# Altium schematic sheet Main.SchDoc
size A4
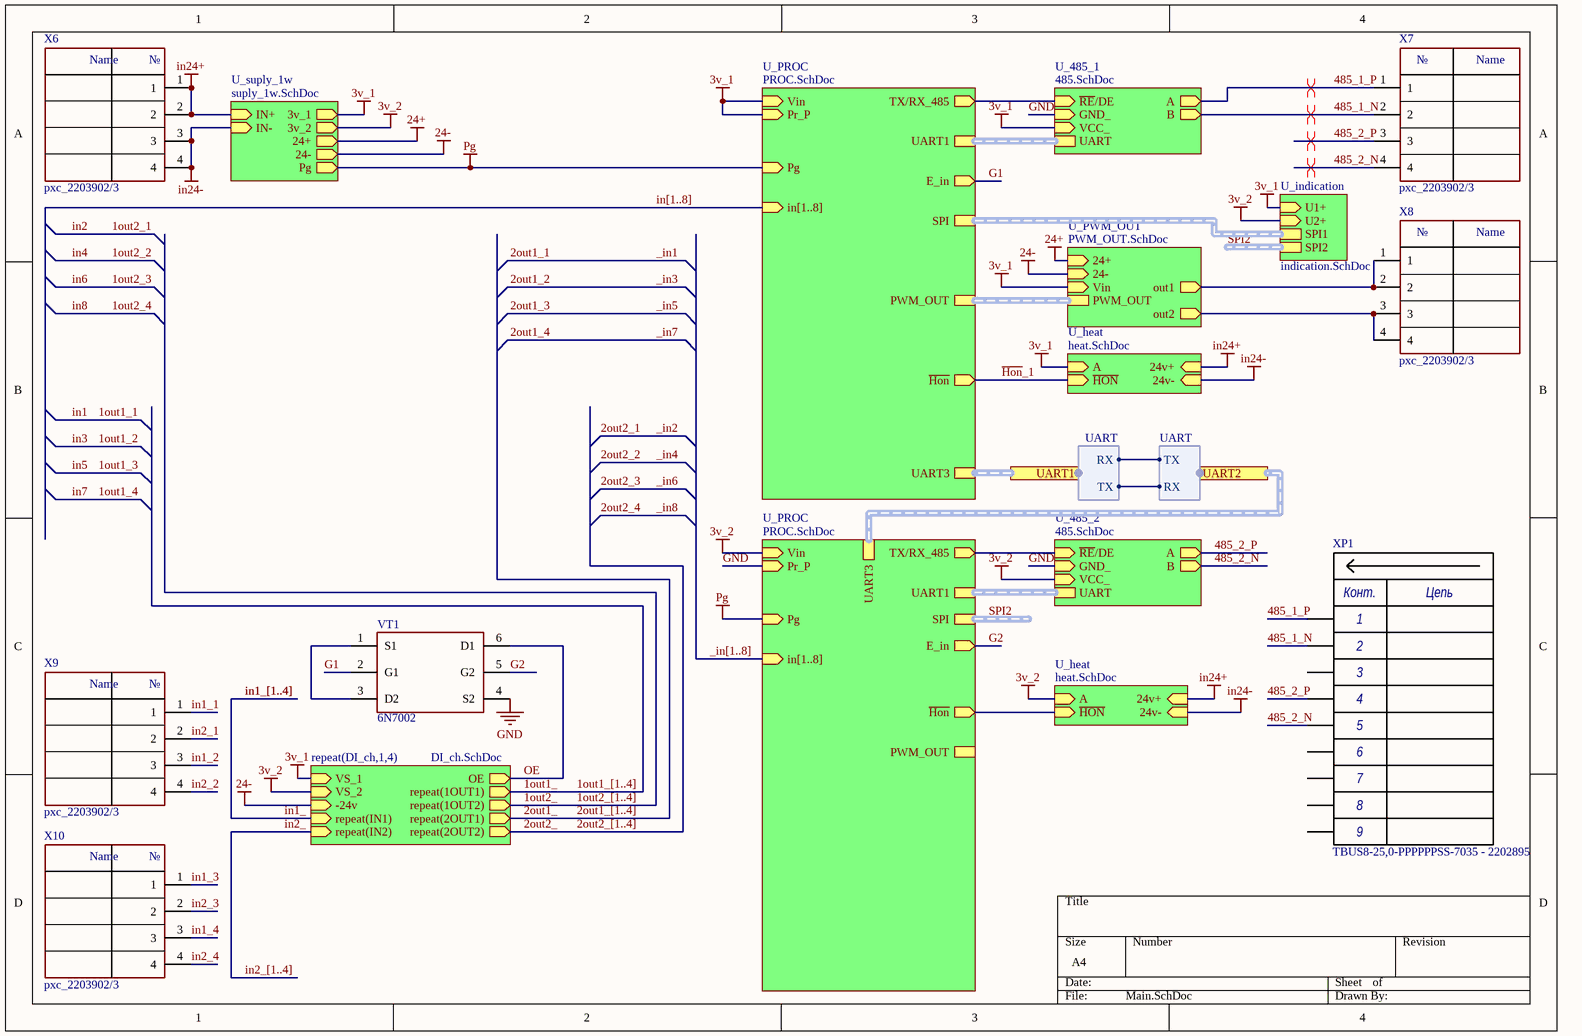
[diagram p0: Main.SchDoc]

## Parts
VT1  6N7002  [sot-23-6]
X6  pxc_2203902/3  [pxc_2203902]
X7  pxc_2203902/3  [pxc_2203902]
X8  pxc_2203902/3  [pxc_2203903]
X9  pxc_2203902/3  [pxc_2203903]
X10  pxc_2203902/3  [pxc_2203903]
XP1  TBUS8-25,0-PPPPPPSS-7035 - 2202895  [TBUS8-25,0-PPPPPPSS-7035 - 2202895]

## Sub-sheets
repeat(DI_ch,1,4) = DI_ch.SchDoc: VS_1 (in), OE (out), -24v (in), repeat(IN1) (in), repeat(IN2) (in), VS_2 (in), repeat(1OUT1) (out), repeat(1OUT2) (out), repeat(2OUT1) (out), repeat(2OUT2) (out)
U_485_1 = 485.SchDoc: ~{RE}/DE (in), GND_ (in), VCC_ (in), A (out), B (out), UART (harness UART)
U_485_2 = 485.SchDoc: ~{RE}/DE (in), GND_ (in), VCC_ (in), A (out), B (out), UART (harness UART)
U_heat = heat.SchDoc: A (in), ~{HON} (in), 24v+ (in), 24v- (in)
U_heat = heat.SchDoc: A (in), ~{HON} (in), 24v+ (in), 24v- (in)
U_indication = indication.SchDoc: U1+ (in), U2+ (in), SPI1 (harness SPI), SPI2 (harness SPI)
U_PROC = PROC.SchDoc: Vin (in), UART1 (harness UART), TX/RX_485 (out), SPI (harness SPI), UART3 (harness UART), PWM_OUT (harness PWM_OUT), Pr_P (in), in[1..8] (in), ~{Hon} (out), Pg (in), E_in (out)
U_PROC = PROC.SchDoc: Vin (in), UART1 (harness UART), TX/RX_485 (out), SPI (harness SPI), UART3 (harness UART), PWM_OUT (harness PWM_OUT), Pr_P (in), in[1..8] (in), ~{Hon} (out), Pg (in), E_in (out)
U_PWM_OUT = PWM_OUT.SchDoc: out2 (out), 24+ (in), 24- (in), out1 (out), Vin (in), PWM_OUT (harness PWM_OUT)
U_suply_1w = suply_1w.SchDoc: IN+ (in), IN- (in), 3v_1 (out), 3v_2 (out), 24+ (out), 24- (out), Pg (out)

## Ports
UART1 (harness UART), UART2 (harness UART)

## Harnesses
UART: RX, TX

## Nets
3v_1: sheet repeat(DI_ch,1,4)/VS_1, sheet U_suply_1w/3v_1, sheet U_485_1/VCC_, sheet U_PROC/Vin, sheet U_PROC/Pr_P, sheet U_PWM_OUT/Vin, sheet U_indication/U1+, sheet U_heat/A
3v_2: sheet repeat(DI_ch,1,4)/VS_2, sheet U_suply_1w/3v_2, sheet U_485_2/VCC_, sheet U_PROC/Vin, sheet U_indication/U2+, sheet U_heat/A
24+: sheet U_suply_1w/24+, sheet U_PWM_OUT/24+
24-: sheet repeat(DI_ch,1,4)/-24v, sheet U_suply_1w/24-, sheet U_PWM_OUT/24-
GND: VT1.4(S2) ; sheet U_485_1/GND_, sheet U_485_2/GND_, sheet U_PROC/Pr_P
in24+: X6.1 X6.2 ; sheet U_suply_1w/IN+, sheet U_heat/24v+, sheet U_heat/24v+
in24-: X6.3 X6.4 ; sheet U_suply_1w/IN-, sheet U_heat/24v-, sheet U_heat/24v-
Pg: sheet U_suply_1w/Pg, sheet U_PROC/Pg, sheet U_PROC/Pg
1out1_: sheet repeat(DI_ch,1,4)/repeat(1OUT1)
1out2_: sheet repeat(DI_ch,1,4)/repeat(1OUT2)
2out1_: sheet repeat(DI_ch,1,4)/repeat(2OUT1)
2out2_: sheet repeat(DI_ch,1,4)/repeat(2OUT2)
485_1_N: X7.2 XP1.2(2c) ; sheet U_485_1/B
485_1_P: X7.1 XP1.1(1c) ; sheet U_485_1/A
485_2_N: X7.4 XP1.5(5c) ; sheet U_485_2/B
485_2_P: X7.3 XP1.4(4c) ; sheet U_485_2/A
G1: VT1.2(G1) ; sheet U_PROC/E_in
G2: VT1.5(G2) ; sheet U_PROC/E_in
~{Hon}_1: sheet U_PROC/~{Hon}, sheet U_heat/~{HON}
in1_: sheet repeat(DI_ch,1,4)/repeat(IN1)
in1_1: X9.1
in1_2: X9.3
in1_3: X10.1
in1_4: X10.3
in2_: sheet repeat(DI_ch,1,4)/repeat(IN2)
in2_1: X9.2
in2_2: X9.4
in2_3: X10.2
in2_4: X10.4
OE: VT1.6(D1) ; sheet repeat(DI_ch,1,4)/OE
NetVT1_1: VT1.1(S1) VT1.3(D2)
NetX8_1: X8.1 X8.2 ; sheet U_PWM_OUT/out1
NetX8_3: X8.3 X8.4 ; sheet U_PWM_OUT/out2
(unnamed): sheet U_485_1/~{RE}/DE, sheet U_PROC/TX/RX_485
(unnamed): sheet U_485_2/~{RE}/DE, sheet U_PROC/TX/RX_485
(unnamed): sheet U_PROC/~{Hon}, sheet U_heat/~{HON}
(unnamed): port UART2.RX, port UART1.TX
(unnamed): port UART2.TX, port UART1.RX

Not connected (* = marked no-connect by the designer): XP1 3(3c) 6(6c) 7(7e) 8(8e) 9

## Buses and harness runs
bus 1out1_[1..4]
bus 1out2_[1..4]
bus 2out1_[1..4]
bus 2out2_[1..4]
bus _in[1..8] = sheet U_PROC/in[1..8]
bus in1_[1..4]
bus in2_[1..4]
bus in[1..8] = sheet U_PROC/in[1..8]
harness port UART1 = sheet U_PROC/UART3
harness port UART2 = sheet U_PROC/UART3
harness sheet U_485_1/UART = sheet U_PROC/UART1
harness sheet U_485_2/UART = sheet U_PROC/UART1
harness sheet U_indication/SPI1 = sheet U_PROC/SPI
harness sheet U_PROC/PWM_OUT = sheet U_PWM_OUT/PWM_OUT
harness SPI2 = sheet U_indication/SPI2
harness SPI2 = sheet U_PROC/SPI

## Layout directives
differential pair: 485_1_N, 485_1_P, 485_2_N, 485_2_P

## Notes on the sheet
- (in symbol pxc_2203902/3) Name; №
- (in symbol TBUS8-25,0-PPPPPPSS-7035 - 2202895) Конт.; Цепь

## Library data of the parts
XP1 = TBUS8-25,0-PPPPPPSS-7035 - 2202895: Type: TBUS8-25,0-PPPPPPSS-7035 - 2202895